# Altium project mechanism final pcb.PrjPcb
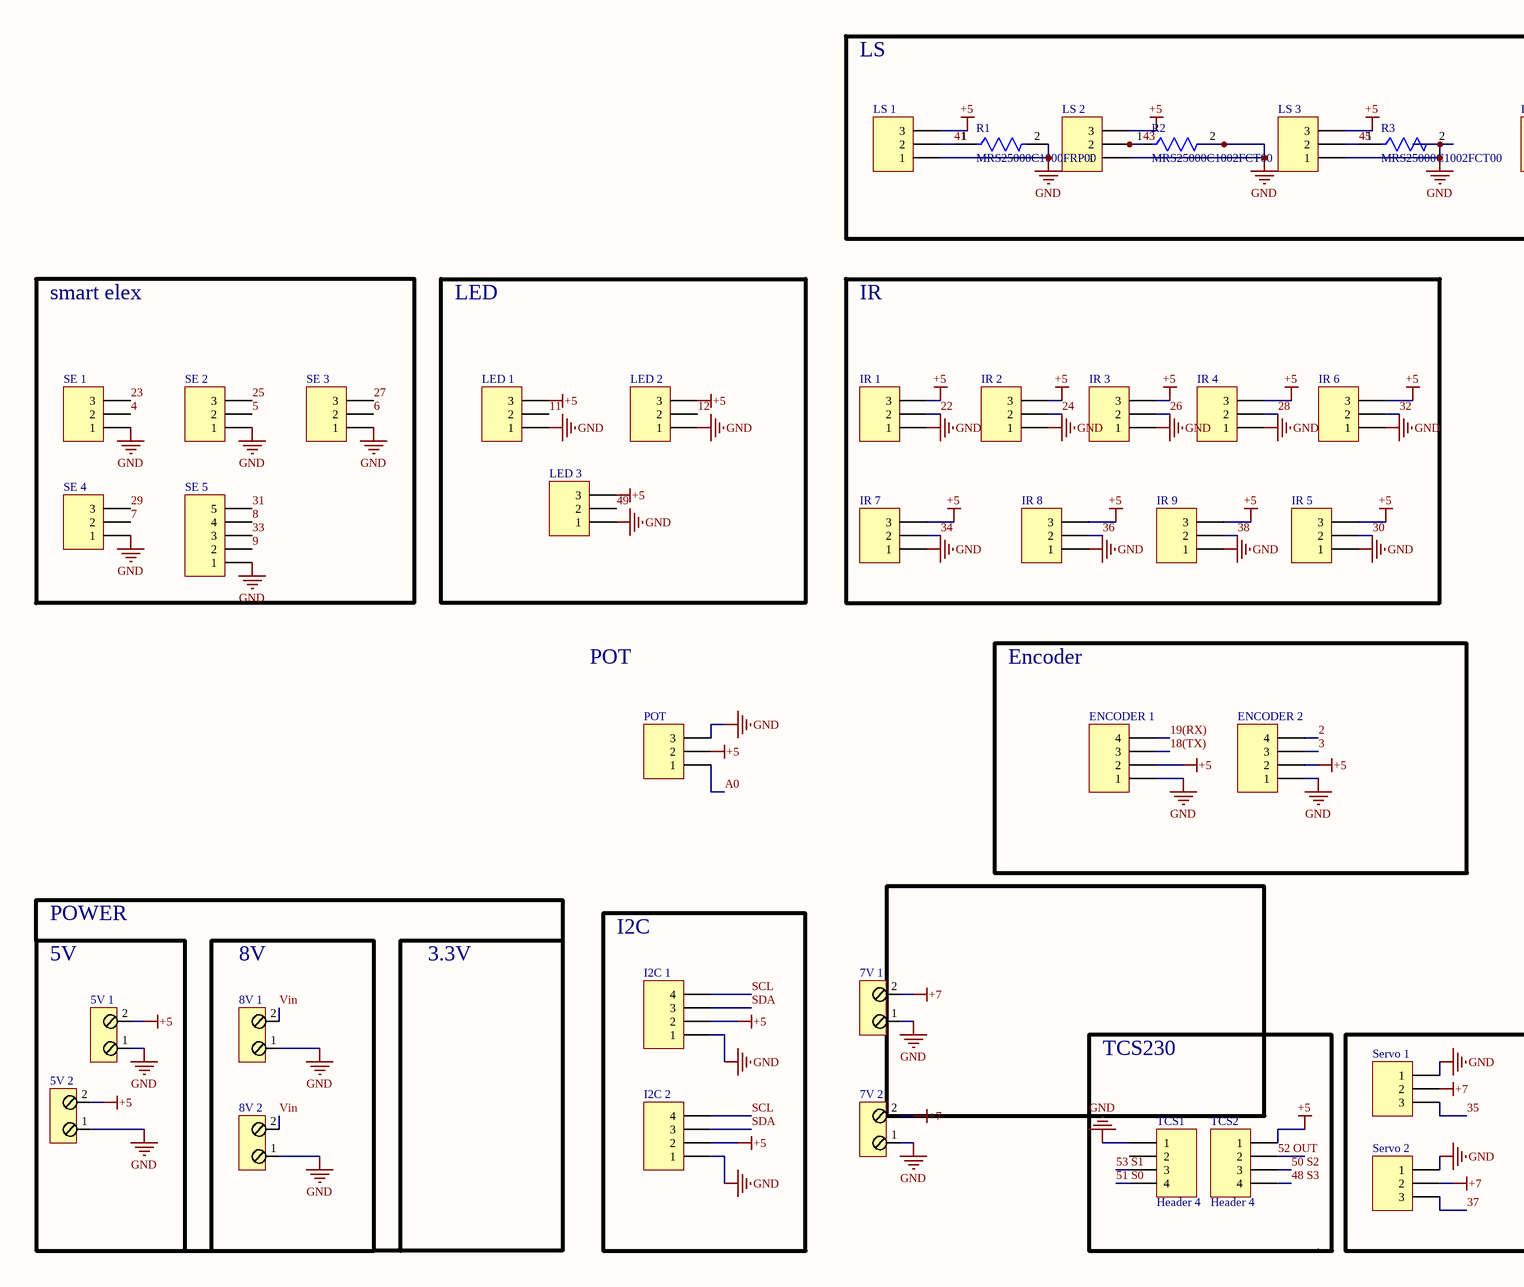
[diagram p0: MECHANISM FINAL PCB.SchDoc, left]
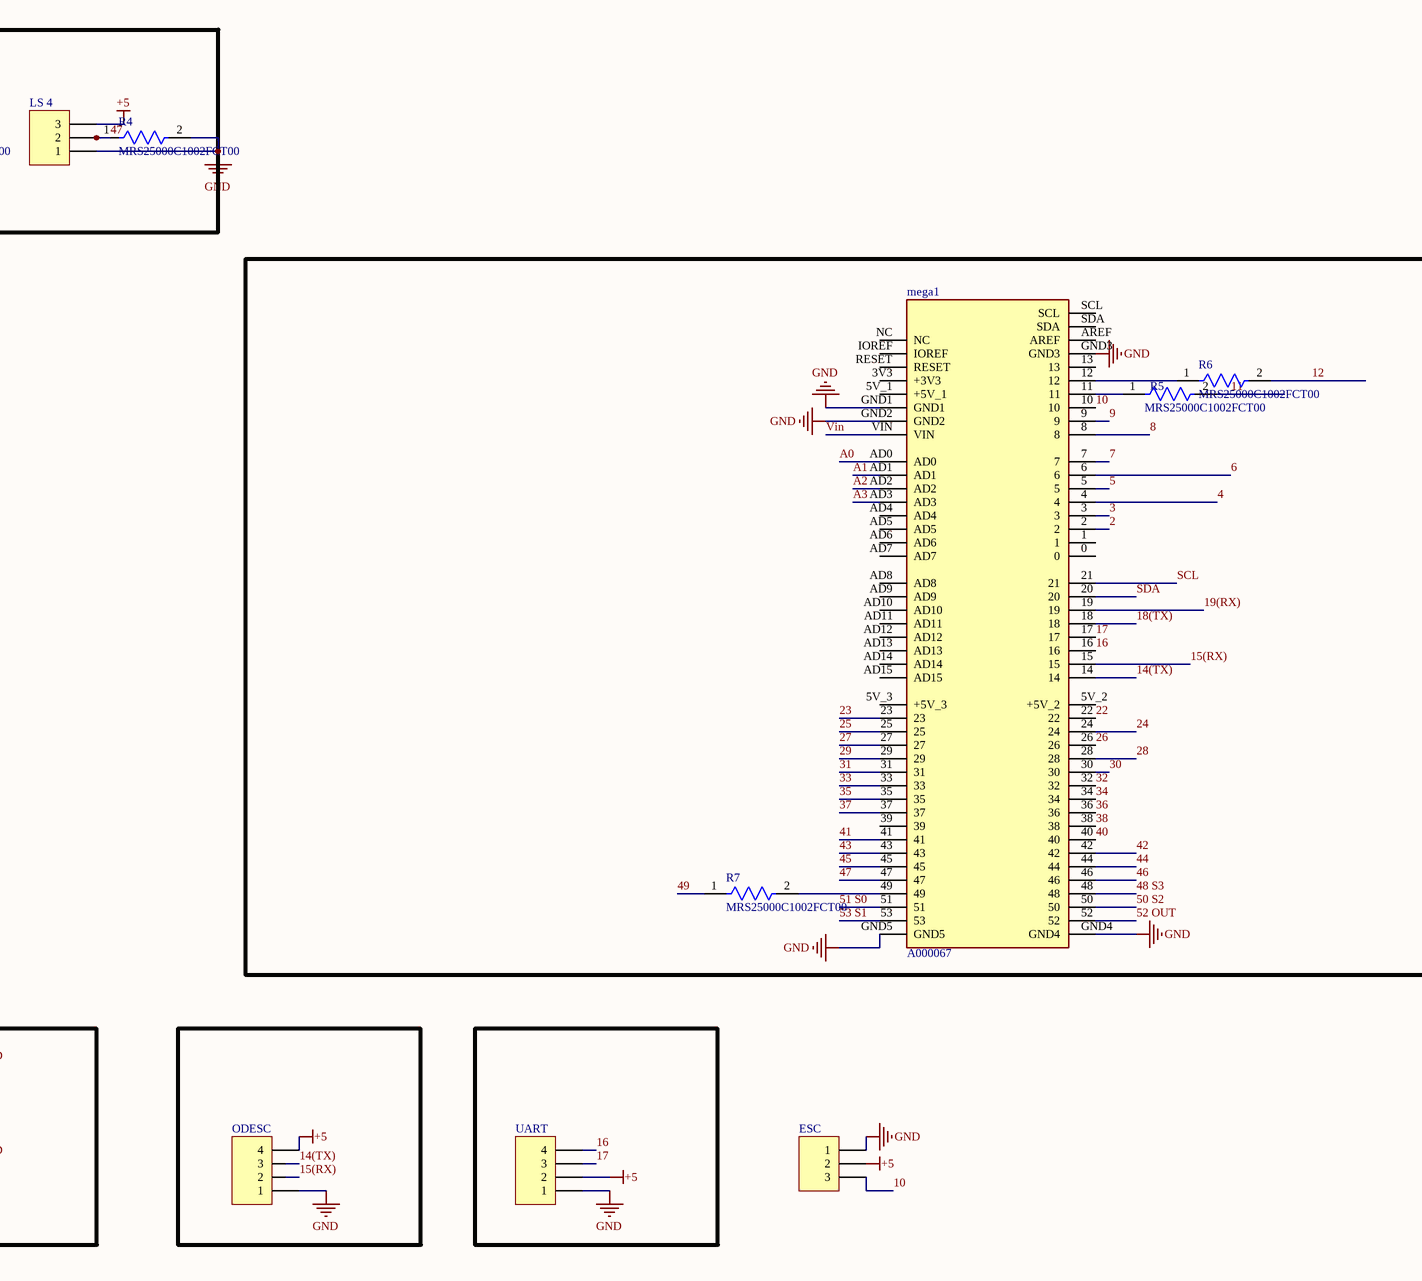
[diagram p1: MECHANISM FINAL PCB.SchDoc, right]
1 sheet, 47 parts. Net scope: global (net labels, ports and power ports of the same name join across sheets).
Board file: MECHANISM FINAL PCB.PcbDoc

## Sheet MECHANISM FINAL PCB.SchDoc
size A2; SheetNumber: 1; SheetTotal: 1

### Parts
5V_1  2-pin-connector  [HDR1X2]  (value not drawn)
5V_2  2-pin-connector  [HDR1X2]  (value not drawn)
7V_1  2-pin-connector  [HDR1X2]  (value not drawn)
7V_2  2-pin-connector  [HDR1X2]  (value not drawn)
8V_1  2-pin-connector  [HDR1X2]  (value not drawn)
8V_2  2-pin-connector  [HDR1X2]  (value not drawn)
ENCODER_1  Header 4  [HDR1X4]  (value not drawn)
ENCODER_2  Header 4  [HDR1X4]  (value not drawn)
ESC  Header 3  [HDR1X3]  (value not drawn)
I2C_1  Header 4  [HDR1X4]  (value not drawn)
I2C_2  Header 4  [HDR1X4]  (value not drawn)
IR_1  Header 3  [HDR1X3]  (value not drawn)
IR_2  Header 3  [HDR1X3]  (value not drawn)
IR_3  Header 3  [HDR1X3]  (value not drawn)
IR_4  Header 3  [HDR1X3]  (value not drawn)
IR_5  Header 3  [HDR1X3]  (value not drawn)
IR_6  Header 3  [HDR1X3]  (value not drawn)
IR_7  Header 3  [HDR1X3]  (value not drawn)
IR_8  Header 3  [HDR1X3]  (value not drawn)
IR_9  Header 3  [HDR1X3]  (value not drawn)
LED_1  Header 3  [HDR1X3]  (value not drawn)
LED_2  Header 3  [HDR1X3]  (value not drawn)
LED_3  Header 3  [HDR1X3]  (value not drawn)
LS_1  Header 3  [HDR1X3]  (value not drawn)
LS_2  Header 3  [HDR1X3]  (value not drawn)
LS_3  Header 3  [HDR1X3]  (value not drawn)
LS_4  Header 3  [HDR1X3]  (value not drawn)
mega1  A000067  [ARDUINO_A000067]
ODESC  Header 4  [HDR1X4]  (value not drawn)
POT  Header 3  [HDR1X3]  (value not drawn)
R1  MRS25000C1000FRP00  [FP-MRS25-MFG]
R2  MRS25000C1002FCT00  [FP-MRS25-MFG]
R3  MRS25000C1002FCT00  [FP-MRS25-MFG]
R4  MRS25000C1002FCT00  [FP-MRS25-MFG]
R5  MRS25000C1002FCT00  [FP-MRS25-MFG]
R6  MRS25000C1002FCT00  [FP-MRS25-MFG]
R7  MRS25000C1002FCT00  [FP-MRS25-MFG]
SE_1  Header 3  [HDR1X3]  (value not drawn)
SE_2  Header 3  [HDR1X3]  (value not drawn)
SE_3  Header 3  [HDR1X3]  (value not drawn)
SE_4  Header 3  [HDR1X3]  (value not drawn)
SE_5  Header 5  [HDR1X5]  (value not drawn)
Servo_1  Header 3  [HDR1X3]  (value not drawn)
Servo_2  Header 3  [HDR1X3]  (value not drawn)
TCS1  Header 4  [HDR1X4]
TCS2  Header 4  [HDR1X4]
UART  Header 4  [HDR1X4]  (value not drawn)

### Blocks framed on the sheet
LS: LS_1-LS_4 R1-R4
smart elex: SE_1-SE_5
LED: LED_1-LED_3
IR: IR_1-IR_9
Encoder: ENCODER_1 ENCODER_2
I2C: I2C_1 I2C_2
TCS230: 7V_1

### Nets
+5: 5V_1.2 5V_2.2 ENCODER_1.2 ENCODER_2.2 ESC.2 I2C_1.2 I2C_2.2 IR_1.3 IR_2.3 IR_3.3 IR_4.3 IR_5.3 IR_6.3 IR_7.3 IR_8.3 IR_9.3 LED_1.3 LED_2.3 LED_3.3 LS_1.3 LS_2.3 LS_3.3 LS_4.3 ODESC.4 POT.2 TCS2.1 UART.2
+7: 7V_1.2 7V_2.2 Servo_1.2 Servo_2.2
GND: 5V_1.1 5V_2.1 7V_1.1 7V_2.1 8V_1.1 8V_2.1 ENCODER_1.1 ENCODER_2.1 ESC.1 I2C_1.1 I2C_2.1 IR_1.1 IR_2.1 IR_3.1 IR_4.1 IR_5.1 IR_6.1 IR_7.1 IR_8.1 IR_9.1 LED_1.1 LED_2.1 LED_3.1 LS_1.1 LS_2.1 LS_3.1 LS_4.1 mega1.GND1 mega1.GND2 mega1.GND3 mega1.GND4 mega1.GND5 ODESC.1 POT.3 R1.2 R2.2 R3.2 R4.2 SE_1.1 SE_2.1 SE_3.1 SE_4.1 SE_5.1 Servo_1.1 Servo_2.1 TCS1.1 UART.1
2: ENCODER_2.4 mega1.2
3: ENCODER_2.3 mega1.3
4: mega1.4 SE_1.2
5: mega1.5 SE_2.2
6: mega1.6 SE_3.2
7: mega1.7 SE_4.2
8: mega1.8 SE_5.4
9: mega1.9 SE_5.2
10: ESC.3 mega1.10
11: LED_1.2 R5.2
12: LED_2.2 R6.2
14(TX): mega1.14 ODESC.3
15(RX): mega1.15 ODESC.2
16: mega1.16 UART.4
17: mega1.17 UART.3
18(TX): ENCODER_1.3 mega1.18
19(RX): ENCODER_1.4 mega1.19
22: IR_1.2 mega1.22
23: mega1.23 SE_1.3
24: IR_2.2 mega1.24
25: mega1.25 SE_2.3
26: IR_3.2 mega1.26
27: mega1.27 SE_3.3
28: IR_4.2 mega1.28
29: mega1.29 SE_4.3
30: IR_5.2 mega1.30
31: mega1.31 SE_5.5
32: IR_6.2 mega1.32
33: mega1.33 SE_5.3
34: IR_7.2 mega1.34
35: mega1.35 Servo_1.3
36: IR_8.2 mega1.36
37: mega1.37 Servo_2.3
38: IR_9.2 mega1.38
40: mega1.40
41: LS_1.2 mega1.41 R1.1
42: mega1.42
43: LS_2.2 mega1.43 R2.1
44: mega1.44
45: LS_3.2 mega1.45 R3.1
46: mega1.46
47: LS_4.2 mega1.47 R4.1
48 S3: mega1.48 TCS2.4
49: LED_3.2 R7.1
50 S2: mega1.50 TCS2.3
51 S0: mega1.51 TCS1.4
52 OUT: mega1.52 TCS2.2
53 S1: mega1.53 TCS1.3
A0: mega1.AD0 POT.1
A1: mega1.AD1
A2: mega1.AD2
A3: mega1.AD3
SCL: I2C_1.4 I2C_2.4 mega1.21
SDA: I2C_1.3 I2C_2.3 mega1.20
Vin: 8V_1.2 8V_2.2 mega1.VIN
Netmega1_11: mega1.11 R5.1
Netmega1_12: mega1.12 R6.1
Netmega1_49: mega1.49 R7.2

Not connected (* = marked no-connect by the designer): mega1 0 1 3V3(+3V3) 5V_1(+5V_1) 5V_2(+5V_2) 5V_3(+5V_3) 13 39 AD4 AD5 AD6 AD7 AD8 AD9 AD10 AD11 AD12 AD13 AD14 AD15 AREF IOREF NC RESET SCL SDA; TCS1 2

### Notes on the sheet
- POT
- POWER
- 5V
- 8V
- 3.3V

### Library data of the parts
ENCODER_1 ENCODER_2 I2C_1 I2C_2 ODESC TCS1 TCS2 UART = Header 4: Header, 4-Pin; LatestRevisionDate: 17-Jul-2002; LatestRevisionNote: Re-released for DXP Platform.; Publisher: Altium Limited
ESC IR_1-IR_9 LED_1-LED_3 LS_1-LS_4 POT SE_1-SE_4 Servo_1 Servo_2 = Header 3: Header, 3-Pin; LatestRevisionDate: 17-Jul-2002; LatestRevisionNote: Re-released for DXP Platform.; Publisher: Altium Limited
mega1 = CMP-017-000000-1: Arduino Mega 2560 Rev3. ATmega2560 Microcontroller Mega Development Board 16MHz CPU 8KB RAM 4KB/256KB EEPROM/Flash; MP: A000067; Source: A000067.SchLib; Check_prices: https://www.snapeda.com/parts/A000067/Arduino/view-part/?ref=eda; Availability: In Stock; Package: Non-Standard Arduino; Purchase-URL: https://pricing.snapeda.com/search?q=A000067&ref=eda; Value: *; SnapEDA_Link: https://www.snapeda.com/parts/A000067/Arduino/view-part/?ref=snap; MF: Arduino; Component Type: Standard; Design Item ID: A000067; Price: None; Pin Count: 86
R1 = CMP-00030-42757237-1: MRS25000C1000FRP00 Resistor, 100 Ohm, ± 1%, 600 mW, Axial Leaded, Metal Film (Thin Film), Professional; Max Power Dissipation: 600mW; Resistance: 100Ω; Voltage Rating: 350V; Temperature Coefficient: 50ppm/°C; Lead Diameter: 600µm; RoHS: Compliant; Radiation Hardening: No; Schedule B: 8533210090, 8533210090; Length: 6.5mm; Packaging: Tape & Reel (TR); Number of Terminations: 2; Mount: Through Hole; Width: 2.5mm; Tolerance: 1%; Military Standard: Not; Voltage Rating (DC): 350V; Contact Plating: Tin; Number of Pins: 2; Max Operating Temperature: 155°C; NexarPartId: 42757237; Diameter: 2.5mm; Composition: Metal Film, Thin Film; REACH SVHC: Unknown; Power Rating: 600mW; Lead Free: Lead Free; Termination: Axial; Case/Package: Axial; Min Operating Temperature: -55°C
R2-R7 = CMP-00030-42632392-1: MRS25000C1002FCT00 Resistor, 10 kOhm, ± 1%, 600 mW, Axial Leaded, Metal Film (Thin Film), Professional; Power Rating: 600mW; Voltage Rating (DC): 350V; Lead Length: 26mm; Resistance: 10kΩ; Temperature Coefficient: 50ppm/°C; Termination: Axial; Number of Terminations: 2; Diameter: 2.5mm; Composition: Metal Film, Thin Film; Number of Pins: 2; Length: 6.5mm; Military Standard: Not; RoHS: Compliant; NexarPartId: 42632392; Width: 2.5mm; Radiation Hardening: No; Voltage Rating: 350V; Max Power Dissipation: 600mW; Min Operating Temperature: -55°C; Lead Free: Lead Free; Max Operating Temperature: 155°C; Tolerance: 1%; Schedule B: 8533210090, 8533210090; Contact Plating: Tin; Mount: Through Hole; REACH SVHC: Unknown; Case/Package: Conformal
SE_5 = Header 5: Header, 5-Pin; LatestRevisionDate: 17-Jul-2002; LatestRevisionNote: Re-released for DXP Platform.; Publisher: Altium Limited